# Altium schematic sheet boost.SchDoc: Boost
size A; DrawnBy: J. Reimer T. Yeung M. Hirole; Organization: UTAT SS; DocumentNumber: 3; Revision: 2.0; SheetNumber: 3; SheetTotal: 17
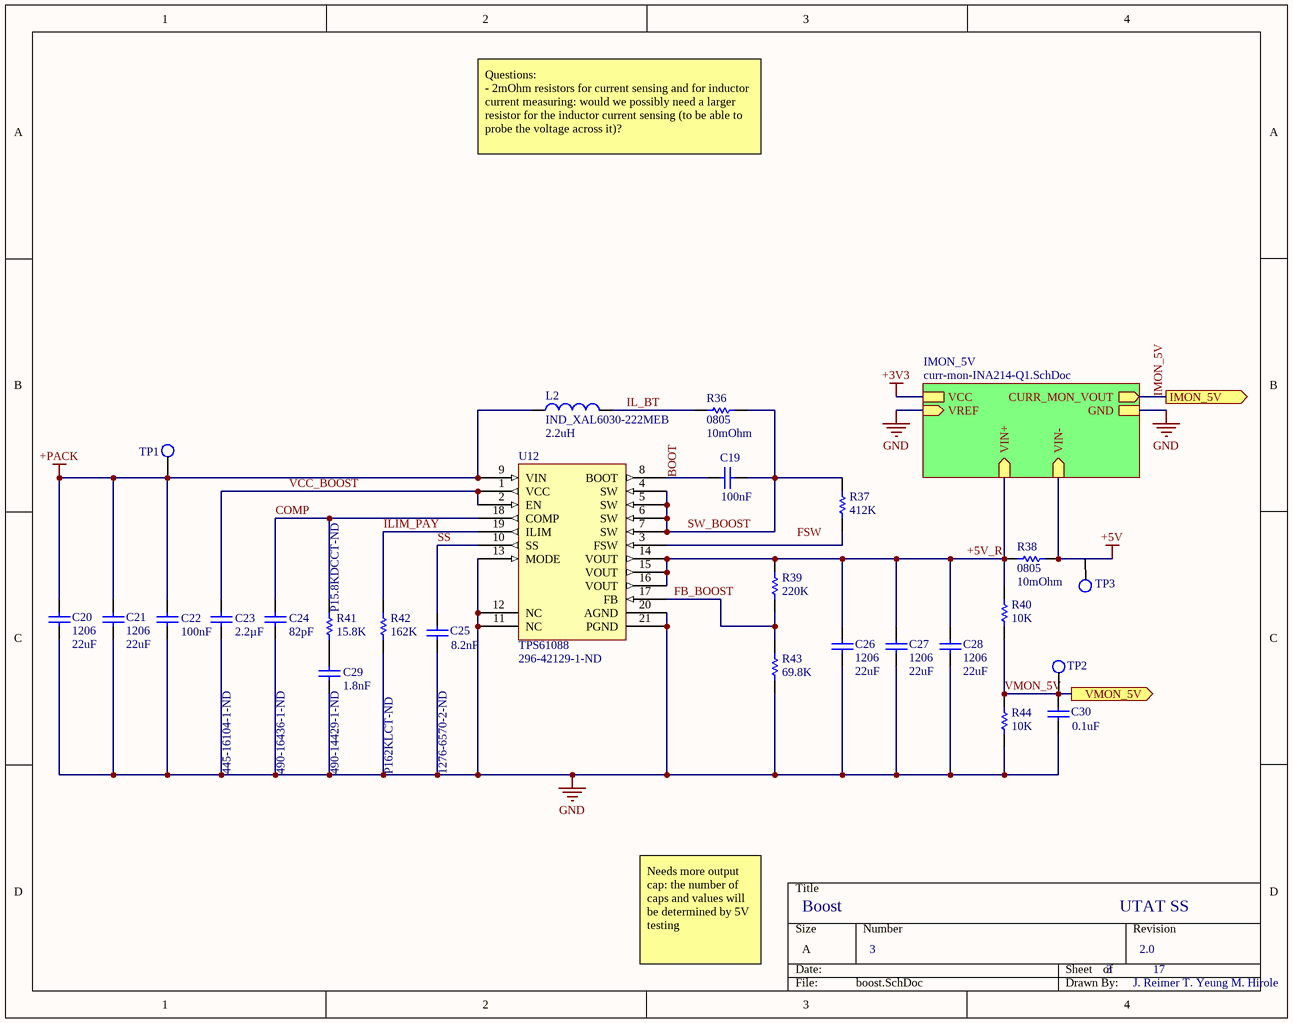
[diagram p0: boost.SchDoc]

## Parts
C19  value 100nF  [CAP0402R]  (hidden comment: 0402)
C20  1206  value 22uF  [CAP1206R]
C21  1206  value 22uF  [CAP1206R]
C22  value 100nF  [CAP0402R]  (hidden comment: 0402)
C23  value 2.2µF  Supplier Part Number 1: 445-16104-1-ND  [CAP0603R]  (hidden comment: 0603)
C24  value 82pF  Supplier Part Number 1: 490-16436-1-ND  [CAP0402R]  (hidden comment: 0402)
C25  value 8.2nF  Supplier Part Number 1: 1276-6570-2-ND  [CAP0402R]  (hidden comment: 0402)
C26  1206  value 22uF  [CAP1206R]
C27  1206  value 22uF  [CAP1206R]
C28  1206  value 22uF  [CAP1206R]
C29  value 1.8nF  Supplier Part Number 1: 490-14429-1-ND  [CAP0402R]  (hidden comment: 0402)
C30  value 0.1uF  [CAP0402R]  (hidden comment: 0402)
L2  IND_XAL6030-222MEB  value 2.2uH  [XAL6030-222MEB]
R36  0805  value 10mOhm  [RES0805R]
R37  value 412K  [RES0402R]  (hidden comment: 0402)
R38  0805  value 10mOhm  [RES0805R]
R39  value 220K  [RES0402R]  (hidden comment: 0402)
R40  value 10K  [RES0402R]  (hidden comment: 0402)
R41  value 15.8K  Supplier Part Number 1: P15.8KDCCT-ND  [RES0402R]  (hidden comment: 0402)
R42  value 162K  Supplier Part Number 1: P162KLCT-ND  [RES0402R]  (hidden comment: 0402)
R43  value 69.8K  [RES0402R]  (hidden comment: 0402)
R44  value 10K  [RES0402R]  (hidden comment: 0402)
U12  TPS61088  Supplier Part Number 1: 296-42129-1-ND  [QFN50P450X350X100-21N]

## Sub-sheets
IMON_5V = curr-mon-INA214-Q1.SchDoc: VREF (in), VIN+ (in), VCC, GND, VIN- (in), CURR_MON_VOUT (out)

## Ports
IMON_5V (out), VMON_5V (out)

## Nets
+3V3: sheet IMON_5V/VCC
+5V: R38.2 ; sheet IMON_5V/VIN-
+PACK: C20.2 C21.2 C22.2 L2.1 U12.9(VIN)
GND: C20.1 C21.1 C22.1 C23.1 C24.1 C25.1 C26.1 C27.1 C28.1 C29.1 C30.2 R42.1 R43.1 R44.1 U12.11(NC) U12.12(NC) U12.13(MODE) U12.20(AGND) U12.21(PGND) ; sheet IMON_5V/VREF, sheet IMON_5V/GND
+5V_R: C26.2 C27.2 C28.2 R38.1 R39.2 R40.2 U12.14(VOUT) U12.15(VOUT) U12.16(VOUT) ; sheet IMON_5V/VIN+
BOOT: C19.2 U12.8(BOOT)
COMP: C24.2 R41.2 U12.18(COMP)
FB_BOOST: R39.1 R43.2 U12.17(FB)
IL_BT: L2.2 R36.1
ILIM_PAY: R42.2 U12.19(ILIM)
IMON_5V: port IMON_5V, sheet IMON_5V/CURR_MON_VOUT
SS: C25.2 U12.10(SS)
SW_BOOST: C19.1 R36.2 R37.1 U12.4(SW) U12.5(SW) U12.6(SW) U12.7(SW)
VCC_BOOST: C23.2 U12.1(VCC) U12.2(EN)
VMON_5V: C30.1 R40.1 R44.2 ; port VMON_5V
NetC29_2: C29.2 R41.1
NetR37_2: R37.2 U12.3(FSW)

## Notes on the sheet
- Questions:
  - 2mOhm resistors for current sensing and for inductor current measuring: would we possibly need a larger resistor for the inductor current sensing (to be able to probe the voltage across it)?
- TP1
- (near R38) TP3
- (near C30) TP2
- Needs more output cap: the number of caps and values will be determined by 5V testing
- Labels drawn without touching a wire or pin: FSW

## Library data of the parts
C19 C22 C30 = CAP0402: 0402 capacitor
C20 C21 C26-C28 = CAP1206: 1206 capacitor
C23 = CAP0603: 0603 capacitor; Manufacturer: TDK; Manufacturer Part Number: CGA3E1X7S1C225K080AC; Capacitance: 2.2uF; Tolerance: 10%; Voltage Rating: 16V; Dielectric: X7S; Supplier 1: Digi-Key; Stock 1: 772454; Pricing 1: 1=0.3, 10=0.203, 100=0.115, 500=0.08114, 1000=0.071 (USD); Mount: Surface Mount; Case/Package: 0603; Case Code (Metric): 1608; Case Code (Imperial): 0603; Min Operating Temperature: -55°C; Max Operating Temperature: 125°C; Package Quantity: 1; Packaging: Cut Tape; Voltage Rating (DC): 16V; Length: 0.063inch; Width: 0.031inch; Thickness: 0.035inch; Ratings: AEC-Q200; REACH SVHC: No SVHC; Lead Free: Lead Free; ComponentLink1URL: https://product.tdk.com/info/en/catalog/spec/mlccspec_automotive_general_midvoltage_en.pdf?src-supplier=Digi-Key; ComponentLink1Description: https://product.tdk.com/info/en/catalog/spec/mlccspec_automotive_general_midvoltage_en.pdf?src-supplier=Digi-Key; ComponentLink2URL: http://www.farnell.com/datasheets/1936565.pdf?src-supplier=Element14; ComponentLink2Description: http://www.farnell.com/datasheets/1936565.pdf?src-supplier=Element14; ComponentLink3URL: https://product.tdk.com/info/en/catalog/datasheets/mlcc_automotive_general_en.pdf?src-supplier=Digi-Key; ComponentLink3Description: https://product.tdk.com/info/en/catalog/datasheets/mlcc_automotive_general_en.pdf?src-supplier=Digi-Key; ComponentLink4URL: http://product.tdk.com/en/catalog/datasheets/mlcc_automotive_general_en.pdf?src-supplier=Avnet; ComponentLink4Description: http://product.tdk.com/en/catalog/datasheets/mlcc_automotive_general_en.pdf?src-supplier=Avnet; ComponentLink5URL: http://www.farnell.com/datasheets/2292075.pdf?src-supplier=Farnell; ComponentLink5Description: http://www.farnell.com/datasheets/2292075.pdf?src-supplier=Farnell; ComponentLink6URL: http://www.farnell.com/datasheets/1936565.pdf?src-supplier=Farnell; ComponentLink6Description: http://www.farnell.com/datasheets/1936565.pdf?src-supplier=Farnell
C24 = CAP0402: 0402 capacitor; Manufacturer: Murata; Manufacturer Part Number: GCM1555C1H820FA16D; Tolerance: 1%; Voltage Rating: 50V; Supplier 1: Digi-Key; Stock 1: 58762; Pricing 1: 1=0.13, 10=0.09, 100=0.0424, 500=0.0297, 1000=0.02459, 2500=0.02289, 5000=0.02094 (USD); Mount: Surface Mount; Case/Package: 0402; Case Code (Imperial): 0402; Case Code (Metric): 1005; Min Operating Temperature: -55°C; Max Operating Temperature: 125°C; Packaging: Tape and Reel; Capacitance: 82pF; Ratings: AEC-Q200; ComponentLink1URL: http://search.murata.co.jp/Ceramy/image/img/A01X/G101/ENG/GCM1555C1H820FA16-01.pdf?src-supplier=Digi-Key; ComponentLink1Description: http://search.murata.co.jp/Ceramy/image/img/A01X/G101/ENG/GCM1555C1H820FA16-01.pdf?src-supplier=Digi-Key
C25 = CAP0402: 0402 capacitor; Manufacturer: Samsung; Manufacturer Part Number: CL05B822KB5VPNC; Voltage Rating: 50V; Tolerance: 10%; Supplier 1: Digi-Key; Stock 1: 10000; Pricing 1: 10000=0.00495 (USD); Mount: Surface Mount; Case/Package: 0402; Case Code (Metric): 1005; Case Code (Imperial): 0402; Min Operating Temperature: -55°C; Max Operating Temperature: 125°C; Packaging: Tape and Reel; Capacitance: 8.2nF; Features: Soft Termination; Length: 0.039inch; Width: 0.02inch; Thickness: 0.022inch; Ratings: AEC-Q200
C29 = CAP0402: 0402 capacitor; Manufacturer: Murata; Manufacturer Part Number: GCM155R71H182KA37D; Tolerance: 10%; Voltage Rating: 50V; Supplier 1: Digi-Key; Stock 1: 73085; Pricing 1: 1=0.1, 10=0.032, 100=0.0143, 500=0.01022, 1000=0.00803, 2500=0.0073, 5000=0.00671 (USD); Mount: Surface Mount; Case/Package: 0402; Case Code (Imperial): 0402; Case Code (Metric): 1005; Min Operating Temperature: -55°C; Max Operating Temperature: 125°C; Packaging: Cut Tape; Capacitance: 1.8nF; Ratings: AEC-Q200; ComponentLink1URL: http://search.murata.co.jp/Ceramy/image/img/A01X/partnumbering_e_02.pdf?src-supplier=Digi-Key; ComponentLink1Description: http://search.murata.co.jp/Ceramy/image/img/A01X/partnumbering_e_02.pdf?src-supplier=Digi-Key; ComponentLink2URL: http://search.murata.co.jp/Ceramy/image/img/A01X/G101/ENG/GCM155R71H182KA37-01.pdf?src-supplier=Digi-Key; ComponentLink2Description: http://search.murata.co.jp/Ceramy/image/img/A01X/G101/ENG/GCM155R71H182KA37-01.pdf?src-supplier=Digi-Key
L2 = IND_XAL6030-222MEB: Inductor; Manufacturer: Coilcraft; Code_IEC: 1005; Core Material: Composite; Tolerance: 20%; Self Resonant Frequency: 30MHz; Shielding: Shielded; Max DC Current: 10A; DC Resistance (DCR): 13.97mR; Test Frequency: 100kHz; Published: 8-Jun-2000; LatestRevisionDate: 29-May-2009; LatestRevisionNote: IPC-7351 Footprint Added.; PackageReference: 0402-A; Publisher: Altium Limited; PackageDescription: Chip Inductor; Code_JEITA: 0402; ComponentLink1Description: Supplier Link; ComponentLink1URL: https://www.mouser.ca/ProductDetail/Coilcraft/XAL6030-222MEB?qs=sGAEpiMZZMsg%252By3WlYCkU2kWFds1hA9DXj9xdKzQVV4%3D; Supplier 1: Mouser; Manufacturer Part Number: XAL6030-222MEB; Stock 1: 3253; Pricing 1: 1=1.85, 10=1.85, 50=1.85, 100=1.7, 400=1.28, 800=0.942, 1000=0.942, 2000=0.877, 10000=0.877 (USD); Min Operating Temperature: -40°C; Max Operating Temperature: 125°C; Packaging: Tape and Reel; Package Quantity: 20; Inductance: 2.2uH; Termination: SMD/SMT; Length: 6.76mm; Height: 3.1mm; Width: 6.56mm; Lead Free: Contains Lead; Supplier Part Number 1: 994-XAL6030-222MEB
R36 R38 = RES0805: 0805 resistor; Manufacturer: Panasonic; Manufacturer Part Number: ERJ-8BWJR010V; Resistance: 10mR; Power Rating: 1W; Tolerance: 5%; Temperature Coefficient: 200ppm/°C; Supplier 1: Digi-Key; Supplier Part Number 1: P.010AVDKR-ND; Stock 1: 70650; Pricing 1: 1=0.68, 10=0.5, 100=0.2911, 1000=0.16327, 2500=0.15763 (USD); Mount: Surface Mount; Case/Package: 1206; Case Code (Imperial): 1206; Case Code (Metric): 3216; Contact Plating: Tin; Min Operating Temperature: -55°C; Max Operating Temperature: 155°C; Packaging: Tape and Reel; Package Quantity: 1; Termination: SMD/SMT; Composition: Thick Film; Number of Terminations: 2; Military Standard: Not; Max Power Dissipation: 1W; Features: Automotive AEC-Q200; Length: 3.2mm; Height: 0.65mm; Width: 1.6mm; Depth: 1.6mm; Radiation Hardening: No; Lead Free: Lead Free; ComponentLink1URL: http://industrial.panasonic.com/www-data/pdf/AOA0000/AOA0000CE3.pdf?src-supplier=Avnet; ComponentLink1Description: http://industrial.panasonic.com/www-data/pdf/AOA0000/AOA0000CE3.pdf?src-supplier=Avnet; ComponentLink2URL: https://industrial.panasonic.com/cdbs/www-data/pdf/RDN0000/AOA0000C313.pdf?src-supplier=Digi-Key; ComponentLink2Description: https://industrial.panasonic.com/cdbs/www-data/pdf/RDN0000/AOA0000C313.pdf?src-supplier=Digi-Key; ComponentLink3URL: http://uk.rs-online.com/webdocs/13b8/0900766b813b869e.pdf?src-supplier=RSComponents; ComponentLink3Description: http://uk.rs-online.com/webdocs/13b8/0900766b813b869e.pdf?src-supplier=RSComponents
R37 R39 R40 R43 R44 = RES0402: 0402 resistor
R41 = RES0402: 0402 resistor; Manufacturer: Panasonic; Manufacturer Part Number: ERA-2AEB1582X; Resistance: 15.8kR; Power Rating: 63mW; Tolerance: 0.1%; Voltage Rating: 25V; Temperature Coefficient: 25ppm/°C; Voltage Rating (DC): 50V; Supplier 1: Digi-Key; Stock 1: 20576; Pricing 1: 1=0.45, 10=0.321, 100=0.1283, 1000=0.06322, 2500=0.05858, 5000=0.053 (USD); Mount: Surface Mount; Case/Package: 0402; Case Code (Metric): 1005; Case Code (Imperial): 0402; Contact Plating: Tin; Min Operating Temperature: -55°C; Max Operating Temperature: 155°C; Packaging: Tape and Reel; Package Quantity: 10000; Composition: Thin Film,Metal Film; Number of Terminations: 2; Max Power Dissipation: 63mW; Termination: SMD/SMT; Length: 0.039inch; Height: 0.016inch; Width: 0.02inch; Radiation Hardening: No; REACH SVHC: Unknown; Lead Free: Lead Free; ComponentLink1URL: http://industrial.panasonic.com/www-data/pdf/AOA0000/AOA0000CE26.pdf?src-supplier=Avnet; ComponentLink1Description: http://industrial.panasonic.com/www-data/pdf/AOA0000/AOA0000CE26.pdf?src-supplier=Avnet
R42 = RES0402: 0402 resistor; Manufacturer: Panasonic; Manufacturer Part Number: ERJ-2RKF1623X; Resistance: 162kR; Power Rating: 100mW; Tolerance: 1%; Voltage Rating: 50V; Temperature Coefficient: 100ppm/°C; Supplier 1: Digi-Key; Stock 1: 0; Mount: Surface Mount; Case/Package: 0402; Weight: 2.8E-05oz; Case Code (Imperial): 0402; Case Code (Metric): 1005; Contact Plating: Tin; Min Operating Temperature: -55°C; Max Operating Temperature: 155°C; Packaging: Tape and Reel; Package Quantity: 10000; Composition: Thick Film; Termination: SMD/SMT; Number of Terminations: 2; Military Standard: Not; Max Power Dissipation: 100mW; Voltage Rating (DC): 50V; Features: Automotive AEC-Q200; Length: 1mm; Height: 0.35mm; Width: 0.5mm; Depth: 0.5mm; Radiation Hardening: No; REACH SVHC: Yes; Lead Free: Lead Free; ComponentLink1URL: http://www.farnell.com/datasheets/1678782.pdf?src-supplier=Element14; ComponentLink1Description: http://www.farnell.com/datasheets/1678782.pdf?src-supplier=Element14; ComponentLink2URL: http://www.farnell.com/datasheets/1678782.pdf?src-supplier=Farnell; ComponentLink2Description: http://www.farnell.com/datasheets/1678782.pdf?src-supplier=Farnell; ComponentLink3URL: https://www.alliedelec.com/m/d/623f45ff1957d936ff56d46fd1c28cac.pdf?src-supplier=Allied+Electronics; ComponentLink3Description: https://www.alliedelec.com/m/d/623f45ff1957d936ff56d46fd1c28cac.pdf?src-supplier=Allied+Electronics; ComponentLink4URL: http://www.farnell.com/datasheets/1911175.pdf?src-supplier=Farnell; ComponentLink4Description: http://www.farnell.com/datasheets/1911175.pdf?src-supplier=Farnell; ComponentLink5URL: http://www.farnell.com/datasheets/1694929.pdf?src-supplier=Element14; ComponentLink5Description: http://www.farnell.com/datasheets/1694929.pdf?src-supplier=Element14
U12 = TPS61088: Boost converter; Supplier 1: Digi-Key